# Altium schematic sheet 5个焊盘.schdoc
size 127 x 101 mm
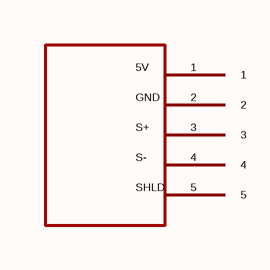
[diagram p0: 5个焊盘.schdoc]

## Parts
U?  5个焊盘  (value not drawn)

## Nets

Not connected (* = marked no-connect by the designer): U? 1 2 3 4 5

## Notes on the sheet
- (in symbol 5个焊盘) 5V; GND; S+; S-; SHLD

## Library data of the parts
U? = 5个焊盘: Convert to PCB: yes; Device: 5个焊盘; Add into BOM: yes; Symbol: 5个焊盘